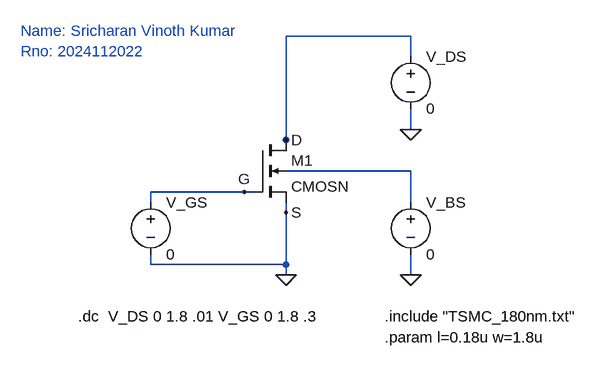
[diagram p0: schematic 3.1.asc]
3.1.asc, the LTspice schematic file:
Version 4.1
SHEET 1 880 680
WIRE 400 -64 208 -64
WIRE 400 -32 400 -64
WIRE 400 80 400 48
WIRE 208 96 208 -64
WIRE 208 112 208 96
WIRE 400 144 208 144
WIRE 144 176 0 176
WIRE 160 176 144 176
WIRE 0 192 0 176
WIRE 400 192 400 144
WIRE 208 208 208 192
WIRE 0 288 0 272
WIRE 208 288 208 208
WIRE 208 288 0 288
WIRE 208 304 208 288
WIRE 400 304 400 272
FLAG 400 304 0
FLAG 208 304 0
FLAG 400 80 0
FLAG 208 96 D
FLAG 208 208 S
FLAG 144 176 G
SYMBOL nmos4 160 96 R0
SYMATTR InstName M1
SYMATTR Value CMOSN
SYMATTR Value2 l=l w=w ad=2.5*l*w as=2.5*l*w pd=5*l+2*w ps=5*l+2*w
SYMBOL voltage 400 176 R0
WINDOW 123 0 0 Left 0
WINDOW 39 0 0 Left 0
SYMATTR InstName V_BS
SYMATTR Value 0
SYMBOL voltage 0 176 R0
SYMATTR InstName V_GS
SYMATTR Value 0
SYMBOL voltage 400 -48 R0
SYMATTR InstName V_DS
SYMATTR Value 0
TEXT 360 368 Left 2 !.include "TSMC_180nm.txt"
TEXT 360 400 Left 2 !.param l=0.18u w=1.8u
TEXT -112 368 Left 2 !.dc  V_DS 0 1.8 .01 V_GS 0 1.8 .3
TEXT -200 -72 Left 2 ;Name: Sricharan Vinoth Kumar\nRno: 2024112022

The netlist it stands for:
* 3.1.asc
M1 D G 0 N001 CMOSN l=l w=w ad=2.5*l*w as=2.5*l*w pd=5*l+2*w ps=5*l+2*w
V_BS N001 0 0
V_GS G 0 0
V_DS D 0 0
.model NMOS NMOS
.model PMOS PMOS
.lib standard.mos
.include "TSMC_180nm.txt"
.param l=0.18u w=1.8u
.dc  V_DS 0 1.8 .01 V_GS 0 1.8 .3
* Name: Sricharan Vinoth Kumar
* Rno: 2024112022
.backanno
.end

* Results of the author's LTspice run, read from the files saved beside the schematic
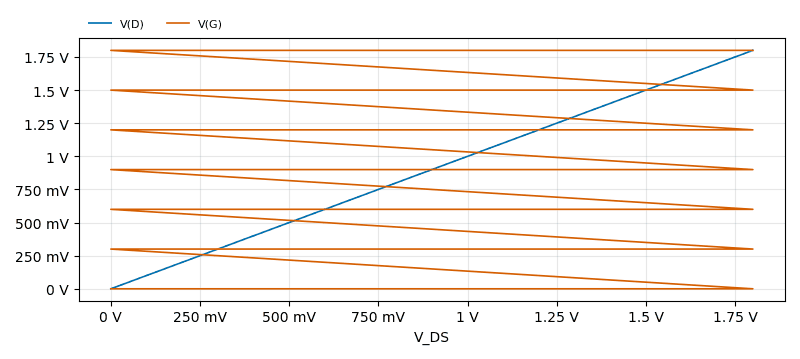
[diagram p1: DC transfer characteristic of 3.1.asc, plotted from the saved traces]
* DC transfer characteristic, 1 run:
*   V(D): 0 V at V_DS=0 V, 1.8 V at V_DS=1.8 V, min 0 V, max 1.8 V
*   V(G): 0 V at V_DS=0 V, 1.8 V at V_DS=1.8 V, min 0 V, max 1.8 V